# Altium schematic sheet MOTORs.SchDoc
size A4
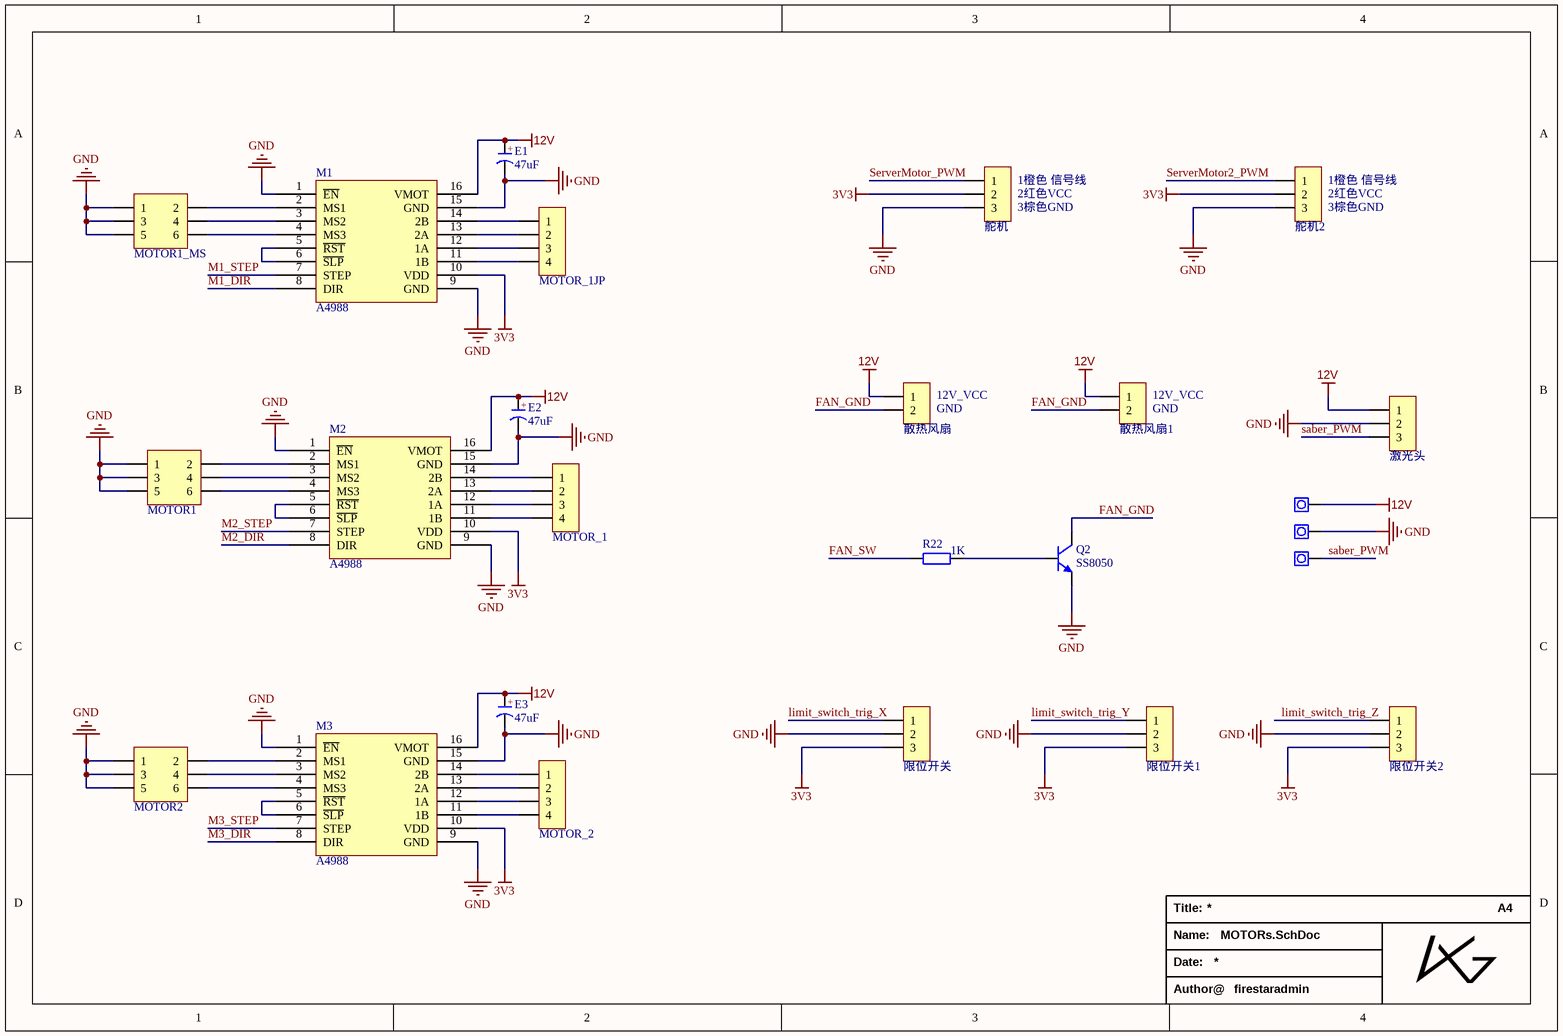
[diagram p0: MOTORs.SchDoc]

## Parts
E1  47uF  [CM D(6.3*5.4)]
E2  47uF  [CM D(6.3*5.4)]
E3  47uF  [CM D(6.3*5.4)]
M1  A4988  [DRV8825]
M2  A4988  [DRV8825]
M3  A4988  [DRV8825]
MOTOR1  Header3X2  [HDR2.54-LI-2x3P]  (value not drawn)
MOTOR1_MS  Header3X2  [HDR2.54-LI-2x3P]  (value not drawn)
MOTOR2  Header3X2  [HDR2.54-LI-2x3P]  (value not drawn)
MOTOR_1  HDR-1X4  [HDR2.54-LI-4P]  (value not drawn)
MOTOR_1JP  HDR-1X4  [HDR2.54-LI-4P]  (value not drawn)
MOTOR_2  HDR-1X4  [HDR2.54-LI-4P]  (value not drawn)
PAD  焊盘2mm*3mm  [PAD-2mm*3mm]  (value not drawn)
PAD1  焊盘2mm*3mm  [PAD-2mm*3mm]  (value not drawn)
PAD2  焊盘2mm*3mm  [PAD-2mm*3mm]  (value not drawn)
Q2  SS8050  [SOT23-3M]
R22  1K  [R 0603_M]
散热风扇  HDR-1X2  [XH2.54-LI-2P]  (value not drawn)
散热风扇1  HDR-1X2  [XH2.54-LI-2P]  (value not drawn)
激光头  HDR-1X3  [HDR2.54-LI-3P]  (value not drawn)
舵机  HDR-1X3  [HDR2.54-LI-3P]  (value not drawn)
舵机2  HDR-1X3  [HDR2.54-LI-3P]  (value not drawn)
限位开关  HDR-1X3  [HDR2.54-LI-3P]  (value not drawn)
限位开关1  HDR-1X3  [HDR2.54-LI-3P]  (value not drawn)
限位开关2  HDR-1X3  [HDR2.54-LI-3P]  (value not drawn)

## Nets
3V3: M1.10(VDD) M2.10(VDD) M3.10(VDD) 舵机.2 舵机2.2 限位开关.3 限位开关1.3 限位开关2.3
12V: E1.1(A) E2.1(A) E3.1(A) M1.16(VMOT) M2.16(VMOT) M3.16(VMOT) PAD.1 散热风扇.1 散热风扇1.1 激光头.1
GND: E1.2(K) E2.2(K) E3.2(K) M1.1(~{EN}) M1.9(GND) M1.15(GND) M2.1(~{EN}) M2.9(GND) M2.15(GND) M3.1(~{EN}) M3.9(GND) M3.15(GND) MOTOR1.1 MOTOR1.3 MOTOR1.5 MOTOR1_MS.1 MOTOR1_MS.3 MOTOR1_MS.5 MOTOR2.1 MOTOR2.3 MOTOR2.5 PAD1.1 Q2.2(E) 激光头.2 舵机.3 舵机2.3 限位开关.2 限位开关1.2 限位开关2.2
FAN_GND: Q2.3(C) 散热风扇.2 散热风扇1.2
FAN_SW: R22.1
limit_switch_trig_X: 限位开关.1
limit_switch_trig_Y: 限位开关1.1
limit_switch_trig_Z: 限位开关2.1
M1_DIR: M1.8(DIR)
M1_STEP: M1.7(STEP)
M2_DIR: M2.8(DIR)
M2_STEP: M2.7(STEP)
M3_DIR: M3.8(DIR)
M3_STEP: M3.7(STEP)
saber_PWM: PAD2.1 激光头.3
ServerMotor2_PWM: 舵机2.1
ServerMotor_PWM: 舵机.1
NetM1_2: M1.2(MS1) MOTOR1_MS.2
NetM1_3: M1.3(MS2) MOTOR1_MS.4
NetM1_4: M1.4(MS3) MOTOR1_MS.6
NetM1_5: M1.5(~{RST}) M1.6(~{SLP})
NetM1_11: M1.11(1B) MOTOR_1JP.4
NetM1_12: M1.12(1A) MOTOR_1JP.3
NetM1_13: M1.13(2A) MOTOR_1JP.2
NetM1_14: M1.14(2B) MOTOR_1JP.1
NetM2_2: M2.2(MS1) MOTOR1.2
NetM2_3: M2.3(MS2) MOTOR1.4
NetM2_4: M2.4(MS3) MOTOR1.6
NetM2_5: M2.5(~{RST}) M2.6(~{SLP})
NetM2_11: M2.11(1B) MOTOR_1.4
NetM2_12: M2.12(1A) MOTOR_1.3
NetM2_13: M2.13(2A) MOTOR_1.2
NetM2_14: M2.14(2B) MOTOR_1.1
NetM3_2: M3.2(MS1) MOTOR2.2
NetM3_3: M3.3(MS2) MOTOR2.4
NetM3_4: M3.4(MS3) MOTOR2.6
NetM3_5: M3.5(~{RST}) M3.6(~{SLP})
NetM3_11: M3.11(1B) MOTOR_2.4
NetM3_12: M3.12(1A) MOTOR_2.3
NetM3_13: M3.13(2A) MOTOR_2.2
NetM3_14: M3.14(2B) MOTOR_2.1
NetQ2_1: Q2.1(B) R22.2

## Notes on the sheet
- (near 舵机) 1橙色 信号线
- (near 舵机) 2红色VCC
- (near 舵机) 3棕色GND
- (near 舵机2) 1橙色 信号线
- (near 舵机2) 2红色VCC
- (near 舵机2) 3棕色GND
- (near 散热风扇) 12V_VCC
- (near 散热风扇) GND
- (near 散热风扇1) 12V_VCC
- (near 散热风扇1) GND
- Title:
- A4
- Name:
- Date:
- Author@
- firestaradmin
- (in symbol C-CM) +

## Library data of the parts
E1-E3 = C-CM: 贴片电解电容; 版权归属: 源创客; BOM名称: 贴片电解电容; 学习资源: www.ooocke.com
M1-M3 = A4988_MODEL: A4988 步进电机驱动
MOTOR1 MOTOR1_MS MOTOR2 = Header 3X2: 3*2P接插件; 版权归属: 源创客; BOM名称: 3*2P接插件; 学习资源: www.ooocke.com
MOTOR_1 MOTOR_1JP MOTOR_2 = Header 4: 4P接插件; 版权归属: 源创客; BOM名称: 4P接插件; 学习资源: www.ooocke.com
PAD PAD1 PAD2 = 焊盘2mm*3mm: 一般来接电源线之类的焊盘
Q2 = 8050-SMD: 高频放大-NPN型; 版权归属: 源创客; 属性: 40V 1.5A 1W 100MHZ; BOM名称: 高频放大-NPN型; 学习资源: www.ooocke.com
R22 = R: 贴片电阻; 版权归属: 源创客; BOM名称: 贴片电阻; 学习资源: www.ooocke.com
散热风扇 散热风扇1 = Header 2: 2P接插件; 版权归属: 源创客; BOM名称: 2P接插件; 学习资源: www.ooocke.com
激光头 舵机 舵机2 限位开关 限位开关1 限位开关2 = Header 3: 3P接插件; 版权归属: 源创客; BOM名称: 3P接插件; 学习资源: www.ooocke.com